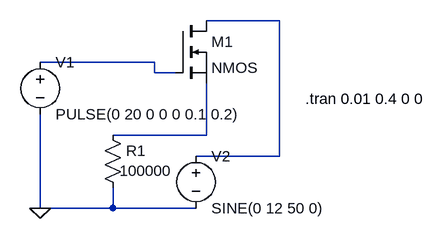
[diagram p0: schematic MosfetAnalogSwitch.asc]
MosfetAnalogSwitch.asc, the LTspice schematic file:
Version 4
SHEET 1 904 680
WIRE 624 256 512 256
WIRE 432 320 256 320
WIRE 432 336 432 320
WIRE 464 336 432 336
WIRE 512 432 512 352
WIRE 512 432 368 432
WIRE 624 464 624 256
WIRE 624 464 496 464
WIRE 256 544 256 400
WIRE 368 544 368 512
WIRE 368 544 256 544
WIRE 496 544 368 544
FLAG 256 544 0
SYMBOL voltage 256 304 R0
SYMATTR InstName V1
SYMATTR Value PULSE(0 20 0 0 0 0.1 0.2)
SYMBOL voltage 496 448 R0
SYMATTR InstName V2
SYMATTR Value SINE(0 12 50 0)
SYMBOL res 352 416 R0
WINDOW 3 26 71 Left 2
SYMATTR InstName R1
SYMATTR Value 100000
SYMBOL nmos 464 256 R0
SYMATTR InstName M1
TEXT 664 376 Left 2 !.tran 0.01 0.4 0 0

The netlist it stands for:
* MosfetAnalogSwitch.asc
V1 N002 0 PULSE(0 20 0 0 0 0.1 0.2)
V2 N001 0 SINE(0 12 50 0)
R1 N003 0 100000
M1 N001 N002 N003 N003 NMOS
.model NMOS NMOS
.model PMOS PMOS
.lib standard.mos
.tran 0.01 0.4 0 0
.backanno
.end